# EAGLE schematic metaPixel-Audio (EAGLE 7.2.0)
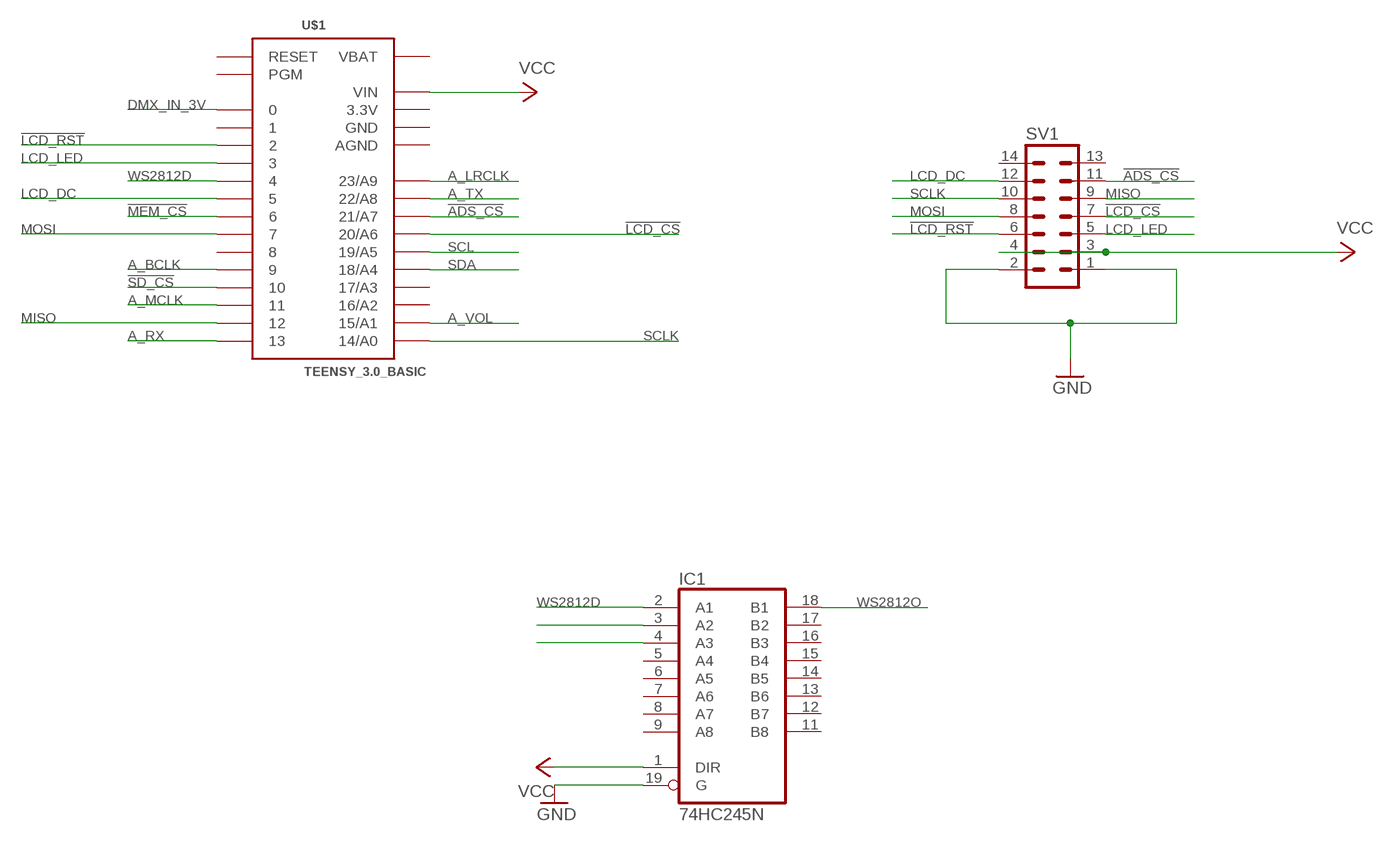
[diagram p0: schematic, sheet 1]

## Parts
IC1  74HC245N  [DIL20]
SV1  ML14  [ML14]
U$1  TEENSY_3.0_BASIC  [TEENSY_3.0_BASIC]

## Nets
!ADS_CS: SV1.11 U$1.21/A7
!LCD_CS: SV1.7 U$1.20/A6
!LCD_RST: SV1.6 U$1.2
!MEM_CS: U$1.6
!SD_CS: U$1.10
A_BCLK: U$1.9
A_LRCLK: U$1.23/A9
A_MCLK: U$1.11
A_RX: U$1.13
A_TX: U$1.22/A8
A_VOL: U$1.15/A1
DMX_IN_3V: U$1.0
GND: IC1.19(G) SV1.1 SV1.2
LCD_DC: SV1.12 U$1.5
LCD_LED: SV1.5 U$1.3
MISO: SV1.9 U$1.12
MOSI: SV1.8 U$1.7
N$1: IC1.3(A2)
N$2: IC1.4(A3)
SCL: U$1.19/A5
SCLK: SV1.10 U$1.14/A0
SDA: U$1.18/A4
VCC: IC1.1(DIR) SV1.3 SV1.4 U$1.VIN
WS2812D: IC1.2(A1) U$1.4
WS2812O: IC1.18(B1)
Unconnected: IC1.5(A4) IC1.6(A5) IC1.7(A6) IC1.8(A7) IC1.9(A8) IC1.11(B8) IC1.12(B7) IC1.13(B6) IC1.14(B5) IC1.15(B4) IC1.16(B3) IC1.17(B2) SV1.13 SV1.14 U$1.1 U$1.8 U$1.16/A2 U$1.17/A3 U$1.PGM U$1.RESET

## Power pins joined to a net without a drawn wire
3.3V: U$1.3.3V U$1.3.3V1(3.3V)
AGND: U$1.AGND
GND: IC1.10(GND) U$1.GND U$1.GND1(GND)
VBAT: U$1.VBAT
VCC: IC1.20(VCC)

## Library data of the parts
IC1 = 74xx-eu:74*245: Octal BUS TRANSCEIVER, 3-state
SV1 = con-harting-ml:ML14: HARTING; OC_FARNELL: unknown; OC_NEWARK: unknown
U$1 = Teensy3.0:TEENSY_3.0_BASIC: Basic Teensy 3.0 with none of the 'inner' pins enabled. See '+4', 'AllAnalogPins", and 'AllPins' packages for additional pin holes, as needed.